# EAGLE design Bv Remote (EAGLE 6.1)
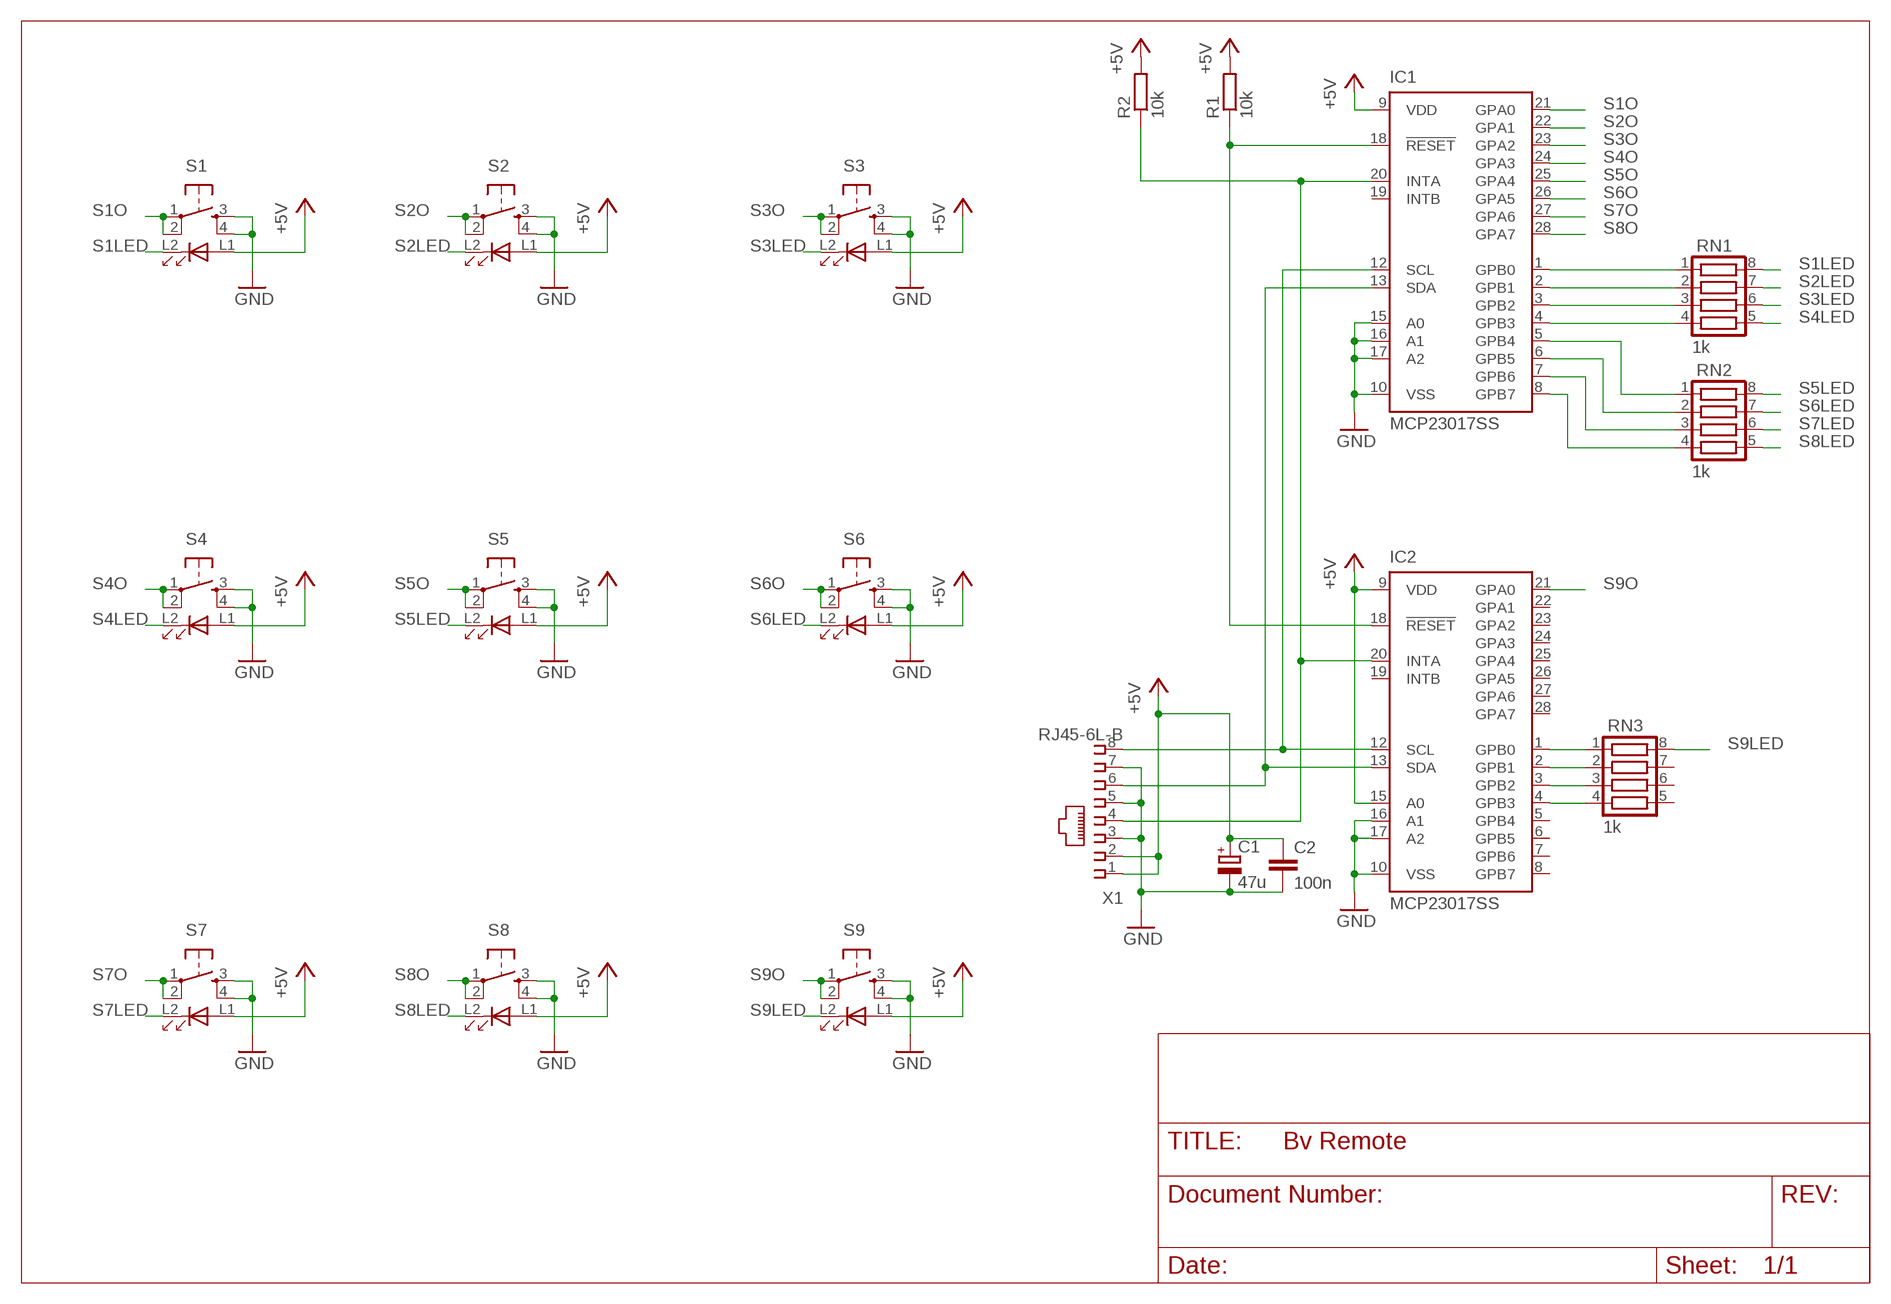
[diagram p0: schematic, sheet 1]

## Parts
C1  47u  CPOL-EU153CLV-1010  [153CLV-1010]
C2  100n  C-EUC1206  [C1206]
IC1  MCP23017SS  [SSOP28]
IC2  MCP23017SS  [SSOP28]
R1  10k  R-EU_R1206  [R1206]
R2  10k  R-EU_R1206  [R1206]
RN1  1k  CTS742C083  [CTS742C083]
RN2  1k  CTS742C083  [CTS742C083]
RN3  1k  CTS742C083  [CTS742C083]
S1  TS_HIGHLY_LED  [PB614_TACT]
S2  TS_HIGHLY_LED  [PB614_TACT]
S3  TS_HIGHLY_LED  [PB614_TACT]
S4  TS_HIGHLY_LED  [PB614_TACT]
S5  TS_HIGHLY_LED  [PB614_TACT]
S6  TS_HIGHLY_LED  [PB614_TACT]
S7  TS_HIGHLY_LED  [PB614_TACT]
S8  TS_HIGHLY_LED  [PB614_TACT]
S9  TS_HIGHLY_LED  [PB614_TACT]
X1  RJ45-6L-B  [RJ45-NO-SHIELD]

## Nets
+5V: C1.+ C2.1 IC1.9(VDD) IC2.9(VDD) IC2.15(A0) R1.2 R2.2 S1.L1(A) S2.L1(A) S3.L1(A) S4.L1(A) S5.L1(A) S6.L1(A) S7.L1(A) S8.L1(A) S9.L1(A) X1.1 X1.2
GND: C1.- C2.2 IC1.10(VSS) IC1.15(A0) IC1.16(A1) IC1.17(A2) IC2.10(VSS) IC2.16(A1) IC2.17(A2) S1.3(S) S1.4(S1) S2.3(S) S2.4(S1) S3.3(S) S3.4(S1) S4.3(S) S4.4(S1) S5.3(S) S5.4(S1) S6.3(S) S6.4(S1) S7.3(S) S7.4(S1) S8.3(S) S8.4(S1) S9.3(S) S9.4(S1) X1.3 X1.5 X1.7
N$1: IC1.1(GPB0) RN1.1
N$2: IC1.2(GPB1) RN1.2
N$3: IC1.3(GPB2) RN1.3
N$4: IC1.4(GPB3) RN1.4
N$5: IC1.5(GPB4) RN2.1
N$6: IC1.6(GPB5) RN2.2
N$7: IC1.7(GPB6) RN2.3
N$8: IC1.8(GPB7) RN2.4
N$9: IC1.12(SCL) IC2.12(SCL) X1.8
N$10: IC1.13(SDA) IC2.13(SDA) X1.6
N$11: IC1.20(INTA) IC2.20(INTA) R2.1 X1.4
N$12: IC1.18(!RESET) IC2.18(!RESET) R1.1
N$17: IC2.1(GPB0) RN3.1
N$18: IC2.2(GPB1) RN3.2
N$19: IC2.3(GPB2) RN3.3
N$20: IC2.4(GPB3) RN3.4
S1LED: RN1.8 S1.L2(C)
S1O: IC1.21(GPA0) S1.1(P) S1.2(P1)
S2LED: RN1.7 S2.L2(C)
S2O: IC1.22(GPA1) S2.1(P) S2.2(P1)
S3LED: RN1.6 S3.L2(C)
S3O: IC1.23(GPA2) S3.1(P) S3.2(P1)
S4LED: RN1.5 S4.L2(C)
S4O: IC1.24(GPA3) S4.1(P) S4.2(P1)
S5LED: RN2.8 S5.L2(C)
S5O: IC1.25(GPA4) S5.1(P) S5.2(P1)
S6LED: RN2.7 S6.L2(C)
S6O: IC1.26(GPA5) S6.1(P) S6.2(P1)
S7LED: RN2.6 S7.L2(C)
S7O: IC1.27(GPA6) S7.1(P) S7.2(P1)
S8LED: RN2.5 S8.L2(C)
S8O: IC1.28(GPA7) S8.1(P) S8.2(P1)
S9LED: RN3.8 S9.L2(C)
S9O: IC2.21(GPA0) S9.1(P) S9.2(P1)
Unconnected: IC1.19(INTB) IC2.5(GPB4) IC2.6(GPB5) IC2.7(GPB6) IC2.8(GPB7) IC2.19(INTB) IC2.22(GPA1) IC2.23(GPA2) IC2.24(GPA3) IC2.25(GPA4) IC2.26(GPA5) IC2.27(GPA6) IC2.28(GPA7) RN3.5 RN3.6 RN3.7

## Library data of the parts
C1 = rcl:CPOL-EU: POLARIZED CAPACITOR, European symbol
C2 = rcl:C-EU: CAPACITOR, European symbol
IC1 IC2 = microchip:MCP23017: http://ww1.microchip.com/downloads/en/DeviceDoc/21952a.pdf Source: http://ww1.microchip.com/downloads/en/DeviceDoc/21952a.pdf; MF: MICROCHIP; MPN: MCP23017-E/SS; OC_FARNELL: 1467674; OC_NEWARK: 31K2960
R1 R2 = rcl:R-EU_: RESISTOR, European symbol
RN1-RN3 = resistor-net:CTS742C083: Chip Resistor Array 4 Single Resistor Source: http://www.ctscorp.com/components/Datasheets/CTSChipArrayDs.pdf; OC_FARNELL: unknown; OC_NEWARK: unknown
S1-S9 = various:TS_HIGHLY_LED
X1 = con-tycoelectronics:RJ45: CORCOM Modular RJ Jacks No Shield Source: www.tycoelectronics.com .. ENG_DS_1654001_1099_RJ_L_0507.pdf; MPN: RJ45-6L-B; OC_FARNELL: unknown; OC_NEWARK: 16R6090

## Net classes
0 default: width 0.254 mm

## Board
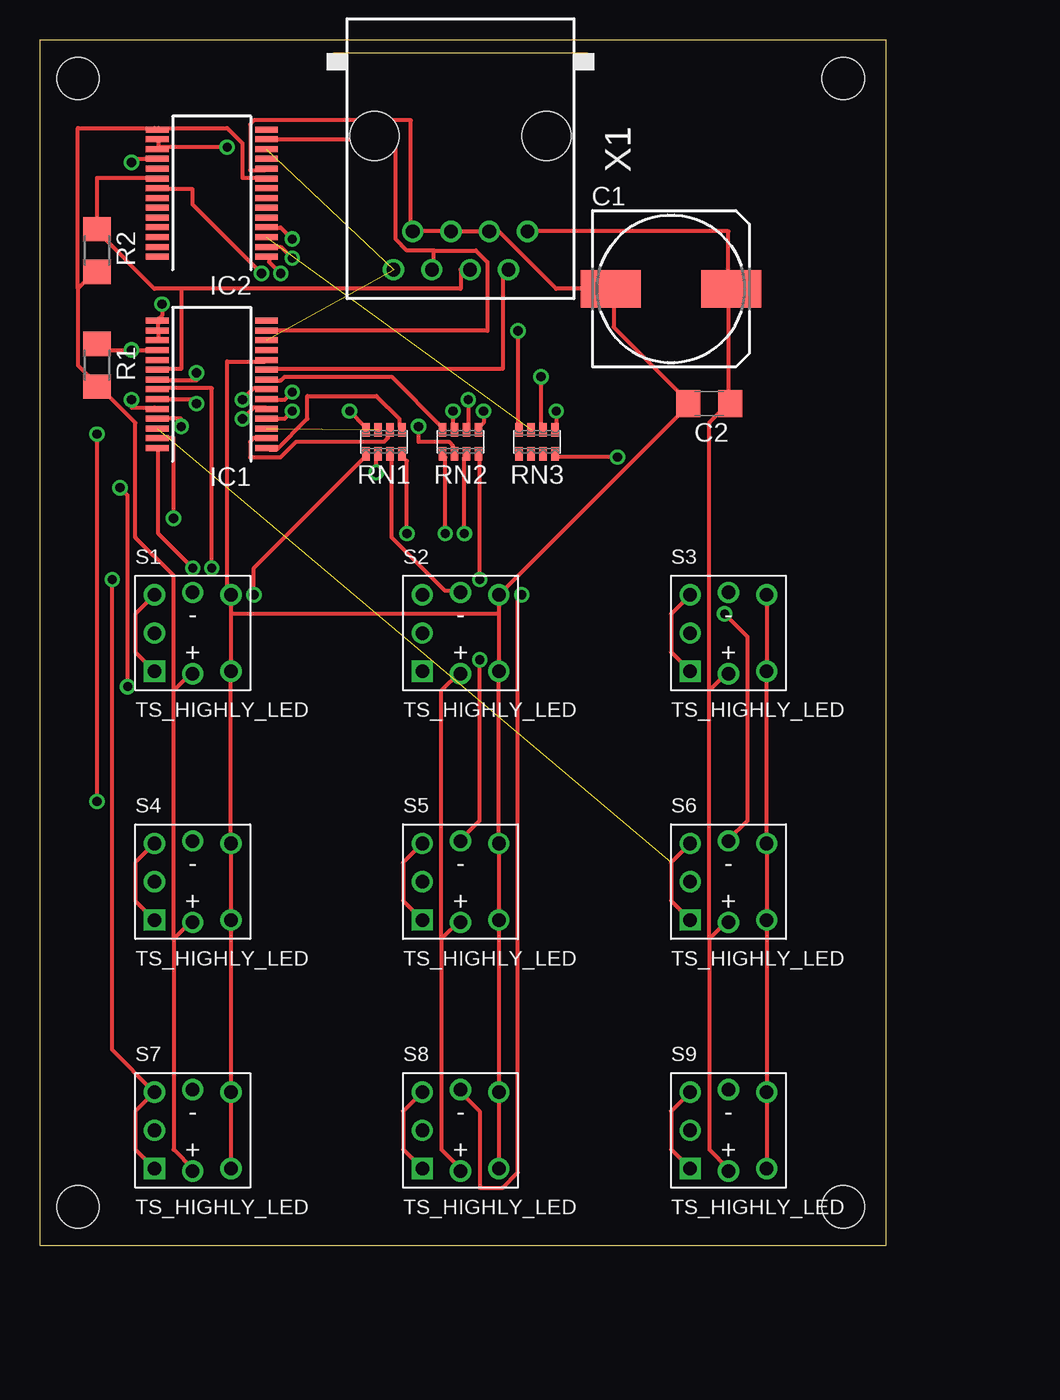
[diagram p1: board, top side]
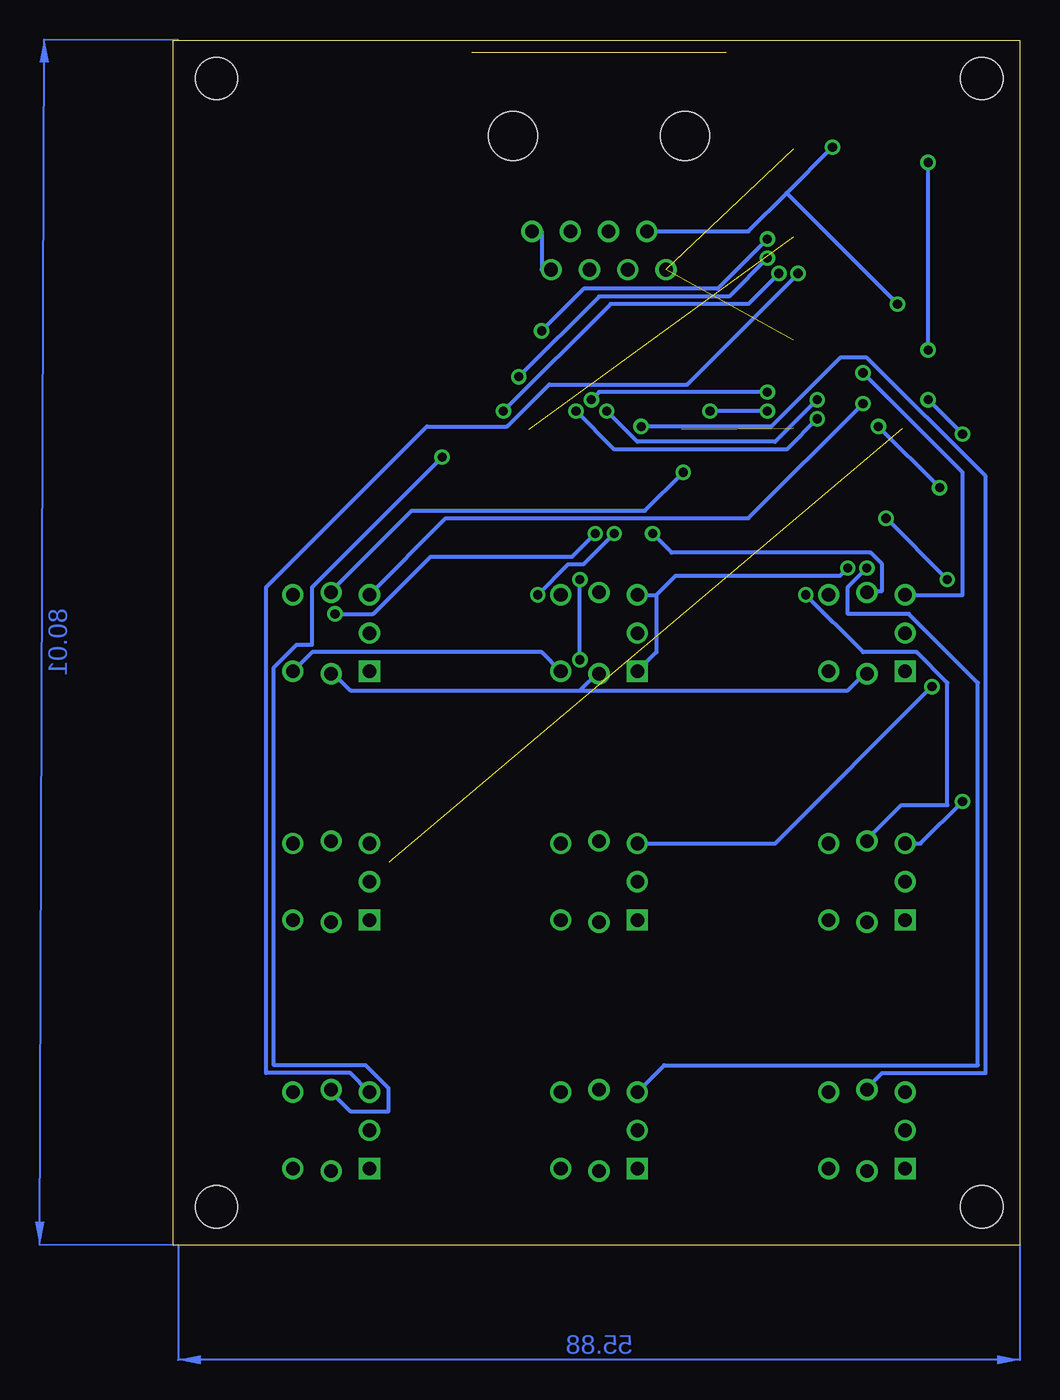
[diagram p2: board, bottom side, seen from below]

Size 56.19 x 80 mm. Coordinates in mm from the lower left corner, seen from the top.
Outline: 0,0 56.19,0 56.19,80 0,80 0,0
Copper layers (1*16): Top 0.035mm / dielectric 1.5mm / Bottom 0.035mm
Design rules: minimum track width 10mil, minimum drill 24mil, track to track 8mil, track to pad 8mil, pad to pad 8mil, via to via 8mil, smd to smd 8mil, copper to edge 40mil, drill to drill 8mil, minimum pad ring 10mil, minimum via ring 8mil, stop-mask expansion 4mil, vias tented up to drill 0mil, thermal gap 10mil
Holes 2.8 mm at 2.54,2.54 53.34,2.54 2.54,77.47 53.34,77.47

### Footprints (pad centres in the part's own frame; a part is rotated, then mirrored left to right if it is on the bottom)
153CLV-1010 = smd 4 x 2.5: + 4,0; - -4,0
C1206 = smd 1.6 x 1.8: 1 -1.4,0; 2 1.4,0
SSOP28 = smd 0.4 x 1.5: 1 -4.225,-3.625; 2 -3.575,-3.625; 3 -2.925,-3.625; 4 -2.275,-3.625; 5 -1.625,-3.625; 6 -0.975,-3.625; 7 -0.325,-3.625; 8 0.325,-3.625; 9 0.975,-3.625; 10 1.625,-3.625; 11 2.275,-3.625; 12 2.925,-3.625; 13 3.575,-3.625; 14 4.225,-3.625; 15 4.225,3.625; 16 3.575,3.625; 17 2.925,3.625; 18 2.275,3.625; 19 1.625,3.625; 20 0.975,3.625; 21 0.325,3.625; 22 -0.325,3.625; 23 -0.975,3.625; 24 -1.625,3.625; 25 -2.275,3.625; 26 -2.925,3.625; 27 -3.575,3.625; 28 -4.225,3.625
R1206 = smd 1.6 x 1.803: 1 -1.422,0; 2 1.422,0
CTS742C083 = smd 0.5 x 0.9: 1 -1.2,-0.8; 2 -0.4,-0.8; 3 0.4,-0.8; 4 1.2,-0.8; 5 1.2,0.8; 6 0.4,0.8; 7 -0.4,0.8; 8 -1.2,0.8
PB614_TACT = drill 0.9 square: 1 -2.54,-2.54 | drill 0.9: 2 -2.54,2.54; 3 2.54,-2.54; 4 2.54,2.54; L1 0,-2.7; L2 0,2.7; NC -2.54,0
RJ45-NO-SHIELD = drill 0.9 pad 1.4: 1 -4.445,6.35; 2 -3.175,8.89; 3 -1.905,6.35; 4 -0.635,8.89; 5 0.635,6.35; 6 1.905,8.89; 7 3.175,6.35; 8 4.445,8.89 | hole 3.251: -5.715,0; 5.715,0

### Placement (x,y rotation side)
C1  41.91,63.5 0 top
C2  44.45,55.88 180 top
IC1  11.43,57.15 90 top
IC2  11.43,69.85 90 top
R1  3.81,58.42 270 top
R2  3.81,66.04 270 top
RN1  22.86,53.34 180 top
RN2  27.94,53.34 180 top
RN3  33.02,53.34 180 top
S1  10.16,40.64 0 top
S2  27.94,40.64 0 top
S3  45.72,40.64 0 top
S4  10.16,24.13 0 top
S5  27.94,24.13 0 top
S6  45.72,24.13 0 top
S7  10.16,7.62 0 top
S8  27.94,7.62 0 top
S9  45.72,7.62 0 top
X1  27.94,73.66 180 top

### Tracks (layer width: path | path; a pad name or v marks a point on that pad's centre or on a via)
+5V
  Top 0.254: 3.81,57.15 2.54,58.42 2.54,63.5 | 2.54,63.5 3.81,64.77 R2.2 | 3.81,57.15 R1.2 3.81,57.15 | 8.89,20.32 8.89,6.35 10.16,5.08 S7.L1 | 8.89,20.32 10.16,21.59 S4.L1 | 8.89,36.83 10.16,38.1 S1.L1 | 8.89,20.32 8.89,36.83 | 3.81,57.15 6.35,54.61 6.35,46.99 8.89,44.45 8.89,36.83 | 26.67,20.32 26.67,6.35 27.94,5.08 S8.L1 | 26.67,20.32 27.94,21.59 S5.L1 | 26.67,20.32 26.67,36.83 27.94,38.1 S2.L1 | 45.72,63.5 45.72,55.88 | 45.72,55.88 C2.1 45.72,55.88 | 45.72,63.5 C1.+ 45.72,63.5 | 45.72,63.5 45.72,67.31 33.02,67.31 X1.1 | 44.45,20.32 44.45,6.35 45.72,5.08 S9.L1 | 44.45,20.32 45.72,21.59 S6.L1 | 44.45,36.83 45.72,38.1 S3.L1 | 44.45,20.32 44.45,36.83 | 45.72,55.88 44.45,54.61 44.45,36.83 | IC2.9 14.99,70.87 13.46,70.87 13.46,73.15 12.45,74.17 7.87,74.17 IC2.15 7.62,74.17 2.54,74.17 2.54,63.5 | IC1.9 15.24,58.17 30.73,58.17 30.73,64.52 30.99,64.77 X1.2
  Bottom 0.254: X1.2 31.75,64.77 31.75,67.31 X1.1 | 29.21,36.83 27.94,38.1 S2.L1 | 29.21,36.83 44.45,36.83 45.72,38.1 S3.L1 | 29.21,36.83 11.43,36.83 10.16,38.1 S1.L1
GND  (via drill 0.61)
  Top 0.254: S3.4 S3.3 S6.4 S6.3 S9.4 S9.3 | 12.7,41.91 S1.4 12.45,43.43 12.45,58.67 14.99,58.67 IC1.10 | 12.7,41.91 S1.3 S4.4 S4.3 S7.4 S7.3 | 43.18,55.88 38.1,60.96 38.1,63.5 C1.- 36.83,63.5 34.29,63.5 30.48,67.31 X1.3 29.21,67.31 27.94,67.31 X1.5 26.67,67.31 25.4,67.31 X1.7 24.64,67.31 24.64,74.68 14.22,74.68 13.97,74.42 13.97,71.37 14.99,71.37 IC2.10 | 43.18,55.88 C2.2 43.18,55.88 | 30.48,41.91 S2.4 43.18,55.88 | 30.48,41.91 S2.3 S5.4 S5.3 S8.4 S8.3 | 30.48,41.91 12.7,41.91 | 7.87,60.71 7.87,60.2 IC1.17 | 7.87,60.71 IC1.16 7.87,60.71 | 7.87,60.71 7.87,61.21 IC1.15 7.87,61.47 8.13,61.72 v8.13,62.48 | 7.87,72.9 7.87,73.41 IC2.16 | 7.87,72.9 IC2.17 7.87,72.9 | v12.45,72.9 7.87,72.9
  Bottom 0.254: S3.3 46.99,39.37 31.75,39.37 S2.3 | 15.49,69.85 18.03,67.31 24.64,67.31 X1.7 | 15.49,69.85 v12.45,72.9 | 15.49,69.85 v8.13,62.48
N$1
  Top 0.254: RN1.1 23.88,54.36 23.88,54.86 22.35,56.39 17.78,56.39 17.78,54.86 15.75,52.83 15.24,52.83 IC1.1
N$2
  Top 0.254: RN1.2 23.11,54.1 23.11,53.59 22.86,53.34 17.02,53.34 16,52.32 13.97,52.32 13.97,53.34 14.22,53.59 14.99,53.59 IC1.2
N$3  (1 unrouted)
N$4  (via drill 0.61)
  Top 0.254: v20.57,55.37 21.59,54.36 RN1.4 | v16.76,55.37 16.26,54.86 15.24,54.86 IC1.4
  Bottom 0.254: v16.76,55.37 v20.57,55.37
N$5  (via drill 0.61)
  Top 0.254: v29.46,55.37 29.46,54.61 29.21,54.36 RN2.1 | v13.46,54.86 14.22,55.63 14.99,55.63 IC1.5
  Bottom 0.254: v29.46,55.37 26.92,52.83 15.49,52.83 v13.46,54.86
N$6  (via drill 0.61)
  Top 0.254: v28.45,56.13 28.45,54.36 RN2.2 | v16.76,56.64 16.26,56.13 15.24,56.13 IC1.6
  Bottom 0.254: v28.45,56.13 27.94,56.64 v16.76,56.64
N$7  (via drill 0.61)
  Top 0.254: v27.43,55.37 27.43,54.36 RN2.3 | v13.46,56.13 14.22,56.9 14.99,56.9 IC1.7
  Bottom 0.254: v27.43,55.37 25.4,53.34 16.26,53.34 v13.46,56.13
N$8
  Top 0.254: RN2.4 26.67,54.36 23.37,57.66 16.26,57.66 16,57.4 15.24,57.4 IC1.8
N$9  (2 unrouted)
N$10
  Top 0.254: 26.16,66.04 28.96,66.04 29.72,65.28 29.72,60.71 15.24,60.71 IC1.13 | 26.16,66.04 26.16,64.77 X1.6 | 26.16,66.04 24.38,66.04 23.62,66.8 23.62,73.41 15.24,73.41 IC2.13
N$11
  Top 0.254: 9.4,63.5 27.94,63.5 27.94,64.77 X1.4 | 9.4,63.5 7.62,63.5 3.81,67.31 R2.1 3.81,67.56 3.81,70.87 7.62,70.87 IC2.20 | 9.4,63.5 9.4,58.17 7.87,58.17 IC1.20
N$12  (via drill 0.61)
  Top 0.254: IC1.18 7.62,59.44 v6.1,59.44 3.81,59.44 3.81,59.69 R1.1 | v6.1,71.88 6.1,72.14 7.62,72.14 IC2.18
  Bottom 0.254: v6.1,59.44 v6.1,71.88
N$17  (via drill 0.61)
  Top 0.254: v34.29,55.37 34.29,54.36 RN3.1 | v16,64.52 15.24,65.28 15.24,65.53 IC2.1
  Bottom 0.254: v34.29,55.37 27.18,62.48 18.03,62.48 v16,64.52
N$18  (via drill 0.61)
  Top 0.254: v33.27,57.66 33.27,54.36 RN3.2 | v16.76,65.53 16,66.29 15.24,66.29 IC2.2
  Bottom 0.254: v33.27,57.66 27.94,62.99 19.3,62.99 v16.76,65.53
N$19  (1 unrouted)
N$20  (via drill 0.61)
  Top 0.254: v31.75,60.71 31.75,54.36 RN3.4 | v16.76,66.8 16,67.56 15.24,67.56 IC2.4
  Bottom 0.254: v31.75,60.71 28.96,63.5 20.07,63.5 v16.76,66.8
S1LED  (via drill 0.61)
  Top 0.254: v24.38,47.24 24.38,52.07 24.13,52.32 RN1.8
  Bottom 0.254: v24.38,47.24 23.11,45.97 9.91,45.97 9.14,45.21 9.14,43.43 10.16,43.43 S1.L2
S1O  (via drill 0.61)
  Top 0.254: S1.1 6.35,39.37 6.35,41.91 S1.2 | v10.41,57.91 10.41,57.4 7.87,57.4 IC1.21
  Bottom 0.254: v10.41,57.91 3.81,51.31 3.81,43.18 S1.2
S2LED
  Top 0.254: RN1.7 23.37,52.32 23.37,46.99 26.92,43.43 27.94,43.43 S2.L2
S2O  (via drill 0.61)
  Top 0.254: v11.43,44.96 11.43,56.9 7.87,56.9 IC1.22
  Bottom 0.254: S2.1 24.13,39.37 24.13,43.18 | S2.2 24.13,43.18 | v11.43,44.96 11.94,44.45 22.86,44.45 24.13,43.18
S3LED  (via drill 0.61)
  Top 0.254: v22.35,51.31 22.35,52.32 RN1.6
  Bottom 0.254: v22.35,51.31 24.89,48.77 40.39,48.77 45.72,43.43 S3.L2
S3O  (via drill 0.61)
  Top 0.254: S3.1 41.91,39.37 41.91,41.91 S3.2 | v10.41,55.88 10.41,56.13 7.87,56.13 IC1.23
  Bottom 0.254: v10.41,55.88 18.03,48.26 38.1,48.26 S3.2
S4LED  (via drill 0.61)
  Top 0.254: v14.22,43.18 14.22,44.96 21.59,52.32 RN1.5
  Bottom 0.254: v14.22,43.18 10.41,39.37 6.86,39.37 4.83,37.34 4.83,29.21 7.87,29.21 10.16,26.92 S4.L2
S4O  (via drill 0.61)
  Top 0.254: S4.1 6.35,22.86 6.35,25.4 S4.2 | v6.1,56.13 6.1,55.63 7.62,55.63 IC1.24 | v3.81,29.46 v3.81,53.85
  Bottom 0.254: v3.81,53.85 v6.1,56.13 | v3.81,29.46 6.6,26.67 S4.2
S5LED  (via drill 0.61)
  Top 0.254: v29.21,44.2 29.21,52.32 RN2.8 | v29.21,38.86 29.21,28.19 27.94,26.92 S5.L2
  Bottom 0.254: v29.21,38.86 v29.21,44.2
S5O  (via drill 0.61)
  Top 0.254: S5.1 24.13,22.86 24.13,25.4 S5.2 | v9.4,54.36 9.4,54.86 7.87,54.86 IC1.25 | v5.33,50.29 5.84,49.78 v5.84,37.08
  Bottom 0.254: v5.33,50.29 v9.4,54.36 | v5.84,37.08 16.26,26.67 S5.2
S6LED  (via drill 0.61)
  Top 0.254: v28.19,47.24 28.19,52.32 RN2.7 | v45.47,41.91 46.99,40.39 46.99,28.19 45.72,26.92 S6.L2
  Bottom 0.254: v28.19,47.24 29.72,45.72 39.12,45.72 42.93,41.91 v45.47,41.91
S6O  (1 unrouted)
  Top 0.254: S6.1 41.91,22.86 41.91,25.4 S6.2
S7LED  (via drill 0.61)
  Top 0.254: v25.15,54.36 25.15,53.34 27.18,53.34 27.43,53.09 27.43,52.58 RN2.6
  Bottom 0.254: v25.15,54.36 16.51,54.36 11.94,58.93 10.16,58.93 2.29,51.05 2.29,11.43 9.14,11.43 10.16,10.41 S7.L2
S7O  (via drill 0.61)
  Top 0.254: S7.1 6.35,6.35 6.35,8.89 S7.2 4.83,12.95 v4.83,44.2 | v8.89,48.26 8.89,53.59 7.87,53.59 IC1.27
  Bottom 0.254: v4.83,44.2 v8.89,48.26
S8LED  (via drill 0.61)
  Top 0.254: v26.92,47.24 26.92,52.32 RN2.5 | v32,43.18 31.75,42.93 31.75,4.83 30.73,3.81 29.21,3.81 29.21,8.89 27.94,10.16 S8.L2
  Bottom 0.254: v26.92,47.24 28.96,45.21 29.97,45.21 v32,43.18
S8O  (via drill 0.61)
  Top 0.254: S8.1 24.13,6.35 24.13,8.89 S8.2 | v10.16,44.96 7.87,47.24 7.87,52.83 IC1.28
  Bottom 0.254: v10.16,44.96 11.43,43.69 11.43,41.91 7.37,41.91 2.79,37.34 2.79,11.94 23.62,11.94 S8.2
S9LED  (via drill 0.61)
  Top 0.254: v38.35,52.32 34.29,52.32 RN3.8
  Bottom 0.254: v38.35,52.32 46.99,43.69 46.99,39.88 48.01,39.88 49.53,38.35 49.53,11.94 43.43,11.94 41.91,10.41 41.91,8.89 44.45,8.89 45.72,10.16 S9.L2
S9O  (via drill 0.61)
  Top 0.254: S9.1 41.91,6.35 41.91,8.89 S9.2 | v14.73,64.52 10.16,69.09 10.16,70.1 7.87,70.1 IC2.21
  Bottom 0.254: v14.73,64.52 22.1,57.15 31.24,57.15 34.04,54.36 39.37,54.36 50.04,43.69 50.04,11.43 44.45,11.43 S9.2
(copper drawn outside any net)
  shapes: Bottom area x2